# EAGLE design testboard (EAGLE 7.1.0)
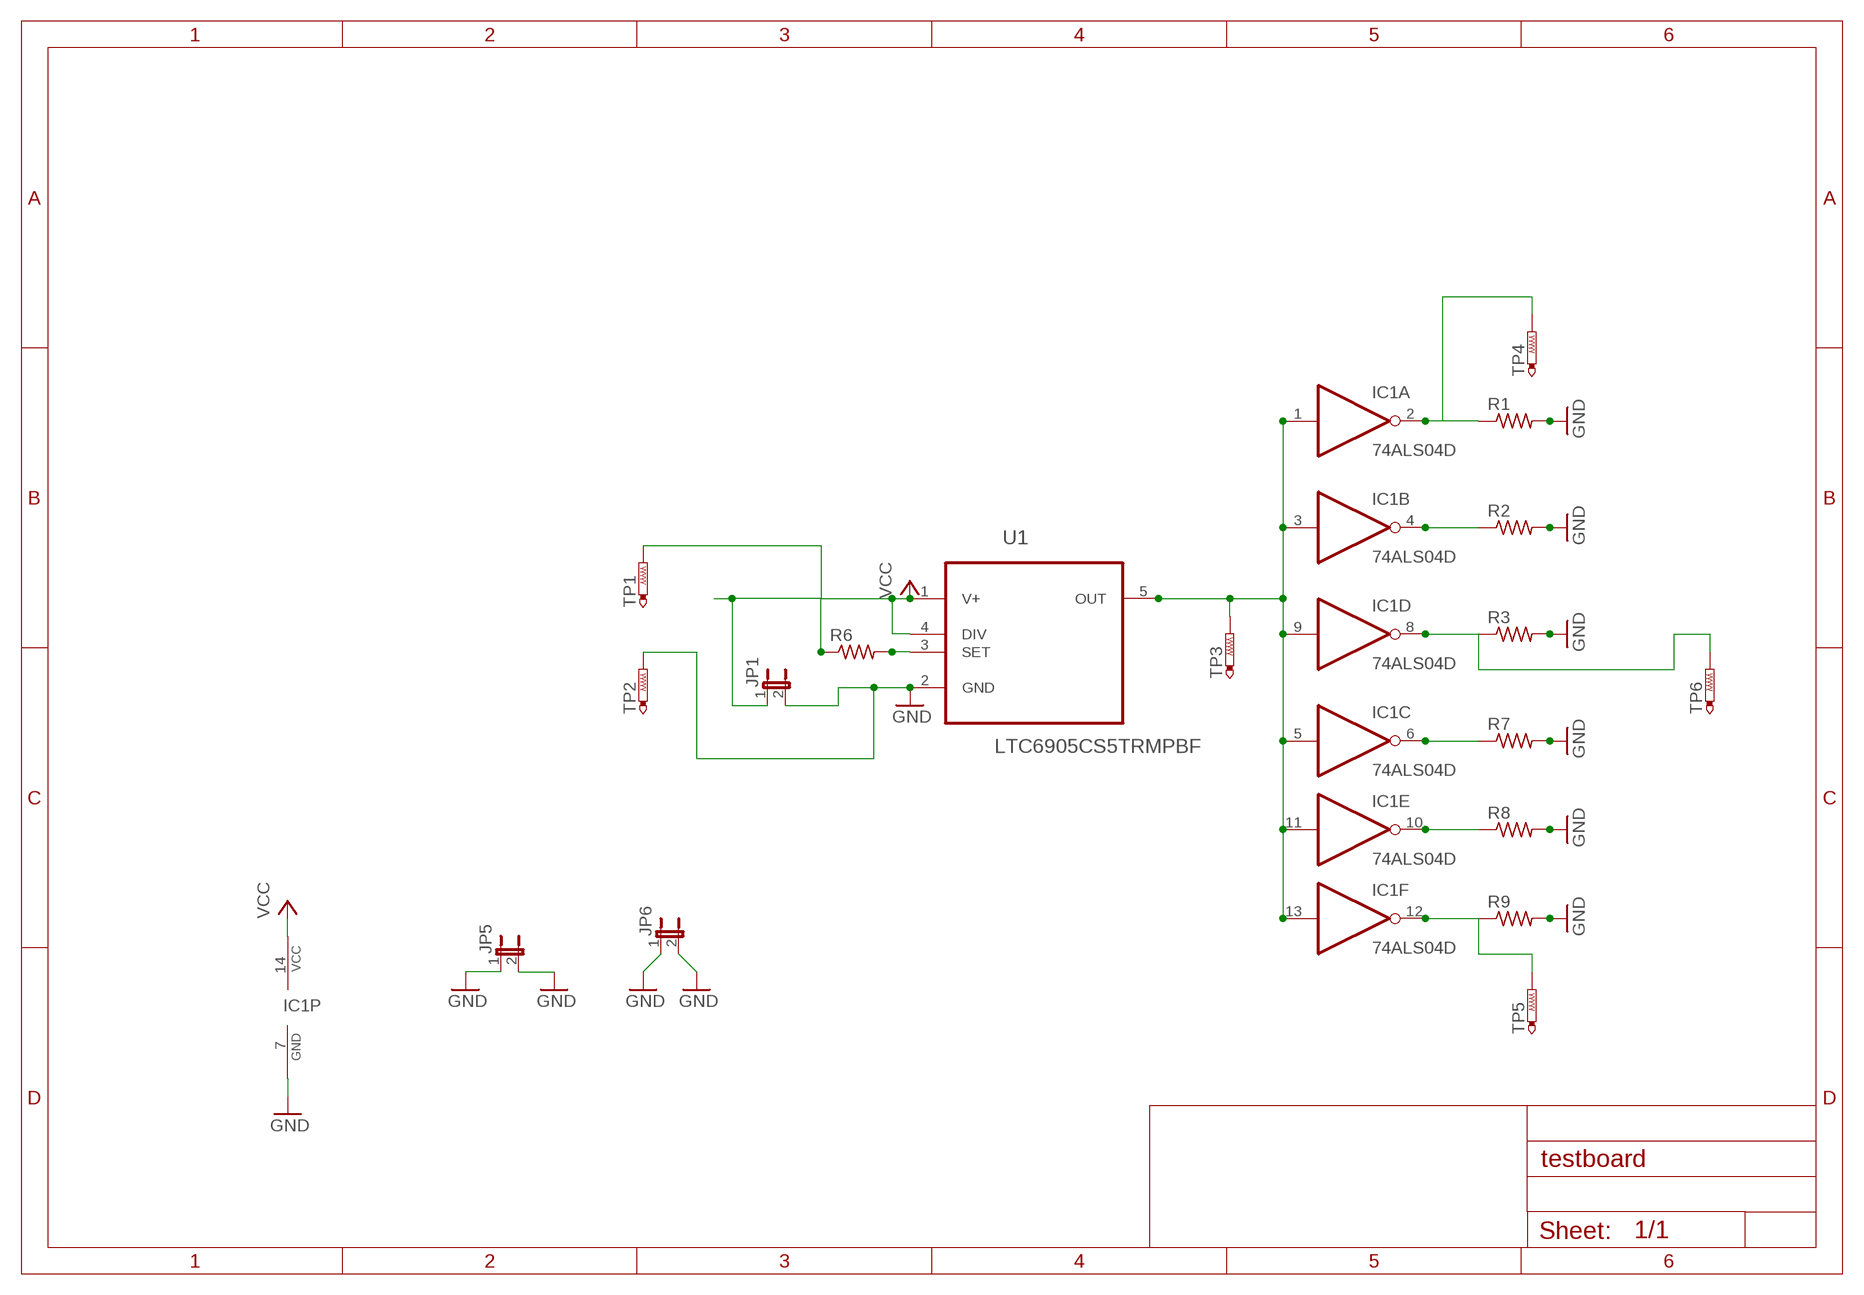
[diagram p0: schematic, sheet 1]

## Parts
IC1  74ALS04D  [SO14]
JP1  JP1E  [JP1]
JP5  JP1E  [JP1]
JP6  JP1E  [JP1]
R1  R-US_0204/2V  [0204V]
R2  R-US_0204/2V  [0204V]
R3  R-US_0204/2V  [0204V]
R6  R-US_0204/2V  [0204V]
R7  R-US_0204/2V  [0204V]
R8  R-US_0204/2V  [0204V]
R9  R-US_0204/2V  [0204V]
TP1  PTR1B2,54  [B2,54]
TP2  PTR1B2,54  [B2,54]
TP3  PTR1B2,54  [B2,54]
TP4  PTR1B2,54  [B2,54]
TP5  PTR1B2,54  [B2,54]
TP6  PTR1B2,54  [B2,54]
U1  LTC6905CS5TRMPBF  [SOT95P280X100-5N]

## Nets
GND: IC1.7(P:GND) JP1.2 JP5.1 JP5.2 JP6.1 JP6.2 R1.2 R2.2 R3.2 R7.2 R8.2 R9.2 TP2.TP U1.2(GND)
N$1: IC1.1(A:I) IC1.3(B:I) IC1.5(C:I) IC1.9(D:I) IC1.11(E:I) IC1.13(F:I) TP3.TP U1.5(OUT)
N$4: IC1.10(E:O) R8.1
N$6: R6.2 U1.3(SET)
N$7: IC1.2(A:O) R1.1 TP4.TP
N$8: IC1.4(B:O) R2.1
N$9: IC1.8(D:O) R3.1 TP6.TP
N$10: IC1.6(C:O) R7.1
N$11: IC1.12(F:O) R9.1 TP5.TP
VCC: IC1.14(P:VCC) JP1.1 R6.1 TP1.TP U1.1(V+) U1.4(DIV)

## Library data of the parts
IC1 = 74xx-us:74*04: Hex INVERTER
JP1 JP5 JP6 = jumper:JP1E: JUMPER
R1-R3 R6-R9 = resistor:R-US_: RESISTOR, American symbol
TP1-TP6 = testpad:PTR1: TEST PIN
U1 = LTC_By_element14_Batch_1:LTC6905CS5TRMPBF: 17MHz to 170MHz Resistor Oscillator; MPN: LTC6905CS5#TRMPBF; OC_FARNELL: 1663923; OC_NEWARK: 19P0750; PACKAGE: SOT-23-5; SUPPLIER: Linear Technology

## Board
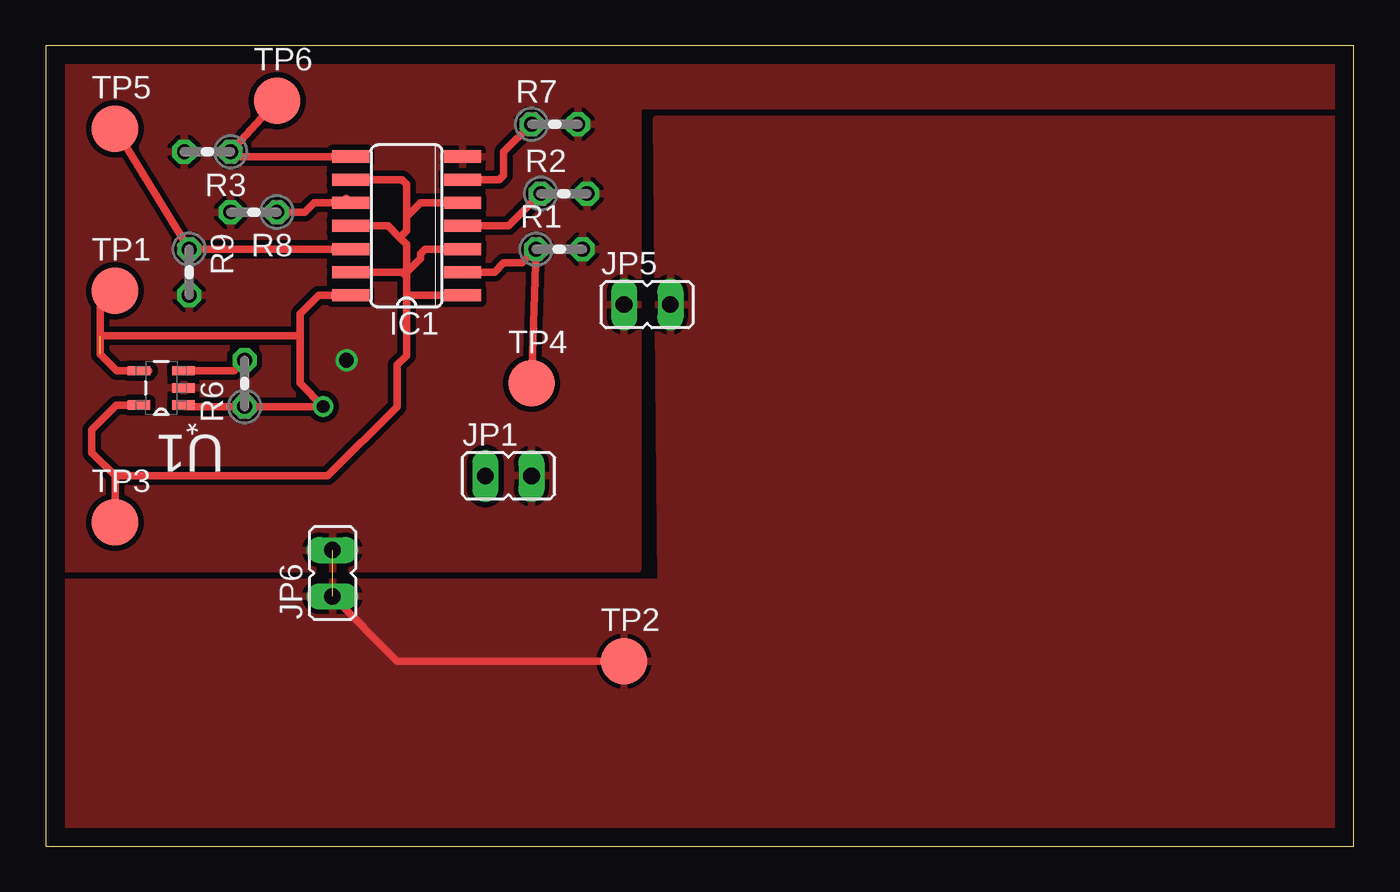
[diagram p1: board, top side]
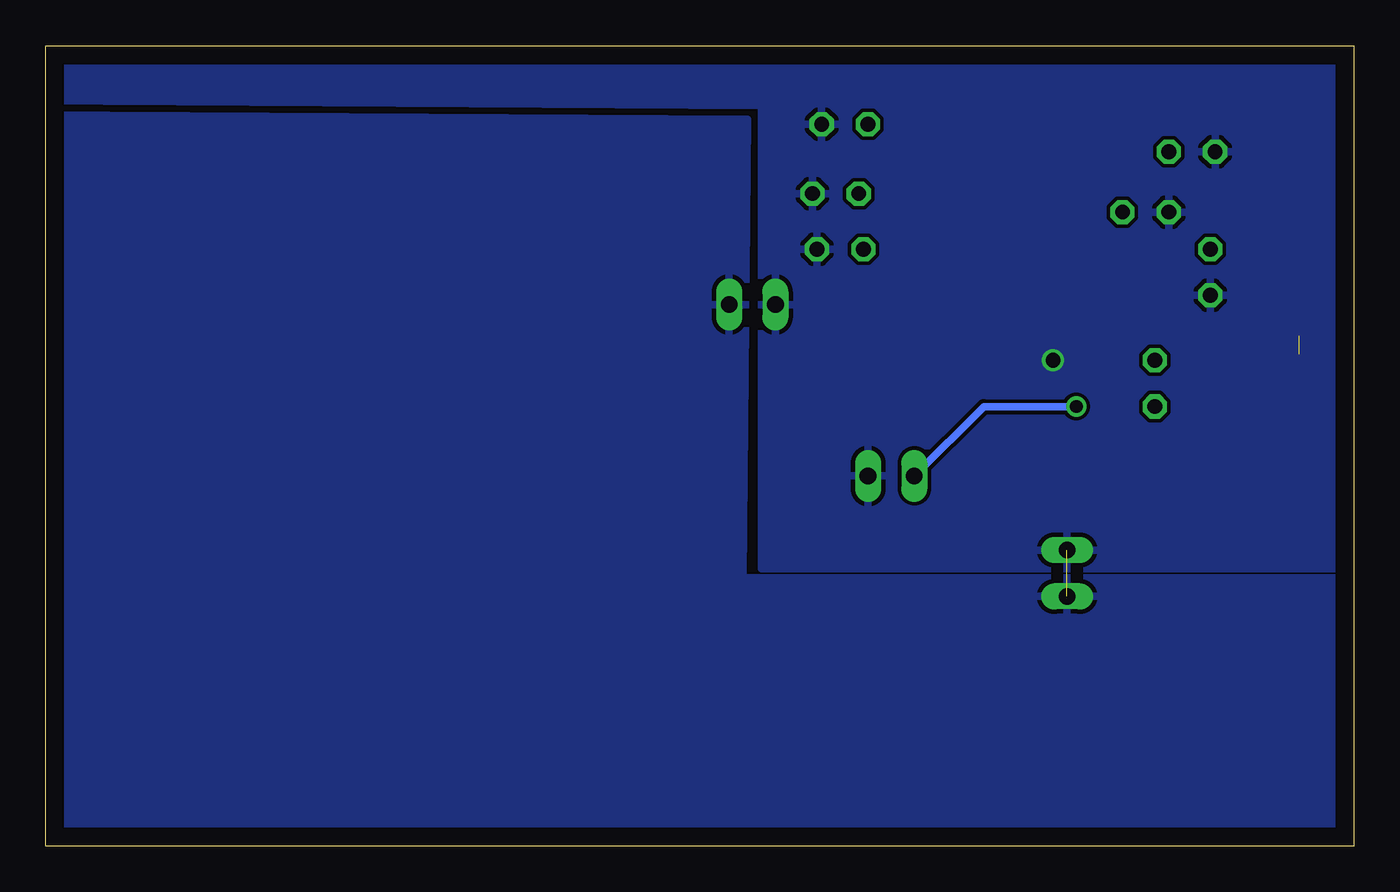
[diagram p2: board, bottom side, seen from below]

Size 71.81 x 43.93 mm. Coordinates in mm from the lower left corner, seen from the top.
Outline: 0,0 71.81,0 71.81,43.93 0,43.93 0,0
Copper layers (1*16): Top 0.035mm / dielectric 1.5mm / Bottom 0.035mm
Design rules "default": minimum track width 10mil, minimum drill 24mil, track to track 8mil, track to pad 8mil, pad to pad 8mil, via to via 8mil, smd to smd 8mil, copper to edge 40mil, drill to drill 8mil, minimum pad ring 10mil, minimum via ring 8mil, stop-mask expansion 4mil, vias tented up to drill 0mil, thermal gap 10mil

### Footprints (pad centres in the part's own frame; a part is rotated, then mirrored left to right if it is on the bottom)
SO14 = smd 0.66 x 2.032: 1 -3.81,-3.073; 2 -2.54,-3.073; 3 -1.27,-3.073; 4 0,-3.073; 5 1.27,-3.073; 6 2.54,-3.073; 7 3.81,-3.073; 8 3.81,3.073; 9 2.54,3.073; 10 1.27,3.073; 11 0,3.073; 12 -1.27,3.073; 13 -2.54,3.073; 14 -3.81,3.073
JP1 = drill 0.914 long: 1 0,-1.27; 2 0,1.27
0204V = drill 0.813 octagon: 1 -1.27,0; 2 1.27,0
B2,54 = smd 2.54 x 2.54: TP 0,0
SOT95P280X100-5N = smd 1.219 x 0.508: 1 -1.219,0.94; 2 -1.219,0; 3 -1.219,-0.94; 4 1.219,-0.94; 5 1.219,0.94

### Placement (x,y rotation side)
IC1  19.81,34.04 90 top
JP1  25.4,20.32 270 top
JP5  33.02,29.72 270 top
JP6  15.75,14.99 0 top
R1  28.19,32.77 0 top
R2  28.45,35.81 0 top
R3  8.89,38.1 180 top
R6  10.92,25.4 90 top
R7  27.94,39.62 0 top
R8  11.43,34.8 180 top
R9  7.87,31.5 270 top
TP1  3.81,30.48 0 top
TP2  31.75,10.16 0 top
TP3  3.81,17.78 0 top
TP4  26.67,25.4 0 top
TP5  3.81,39.37 0 top
TP6  12.7,40.91 0 top
U1  6.35,25.15 180 top

### Tracks (layer width: path | path; a pad name or v marks a point on that pad's centre or on a via)
GND  (via drill 0.8)  (1 unrouted)
  Top 0.406: JP6.1 19.3,10.16 TP2.TP
  other vias: 16.51,26.67
  pour Top (isolate 0.305): 1.02,82.8 98.04,82.8 98.04,40.64 32.51,40.64 32.51,15.24 1.02,15.24
  pour Top (isolate 0.254): 1.02,14.48 33.78,14.48 33.53,39.88 73.41,39.88 72.9,0.51 1.02,0.76
  pour Bottom: -1.02,14.73 -0.76,-1.02 73.66,-0.25 73.66,2.03 72.64,40.13 33.27,39.88 33.53,14.73
  pour Bottom: -1.02,15.24 -0.76,44.2 72.64,44.7 72.64,40.89 32.51,40.64 32.51,15.24
N$1
  Top 0.406: IC1.11 18.8,34.04 19.43,33.4 | 19.43,33.4 19.81,33.02 19.81,31.5 | 19.81,31.5 19.81,31.24 | 19.81,31.24 19.81,30.23 | 19.81,30.23 19.81,26.92 19.3,26.42 19.3,24.13 15.49,20.32 4,20.32 | IC1.3 20.83,32.77 20.57,32.51 20.57,32.26 19.81,31.5 | IC1.9 19.56,36.58 19.81,36.32 19.81,34.54 | 19.81,34.54 19.81,33.78 19.43,33.4 | IC1.13 19.56,31.5 19.81,31.24 | IC1.5 20.57,35.31 19.81,34.54 | IC1.1 19.81,30.23 | U1.5 3.89,24.21 2.54,22.86 2.54,21.59 3.81,20.32 4,20.32 | TP3.TP 3.81,20.13 4,20.32
N$4
  Top 0.406: 16.48,35.56 IC1.10 14.73,35.31 14.22,34.8 R8.1
N$6
  Top 0.406: U1.3 10.34,26.09 R6.2
N$7
  Top 0.406: IC1.2 24.64,31.5 25.15,32 26.16,32 R1.1 TP4.TP
N$8
  Top 0.406: IC1.4 25.4,34.04 R2.1
N$9
  Top 0.406: TP6.TP R3.1 10.41,37.85 IC1.8
N$10
  Top 0.406: IC1.6 24.89,36.58 25.15,36.83 25.15,38.1 R7.1
N$11
  Top 0.406: IC1.12 R9.1 TP5.TP
VCC  (via drill 0.7)  (1 unrouted)
  Top 0.406: 5.66,26.09 U1.4 3.91,26.09 3,27 3,29.67 TP1.TP | 7.54,24.21 U1.1 7.64,24.13 R6.1 v15.24,24.13 13.97,25.4 13.97,28 | IC1.14 14.99,30.23 13.97,29.21 13.97,28 | 3,28 13.97,28
  Bottom 0.406: JP1.1 20.32,24.13 v15.24,24.13